# EAGLE design RS232 to TTL Converter (MAX3232IDR) (EAGLE 9.1.2)

## Sheet 1 of 2
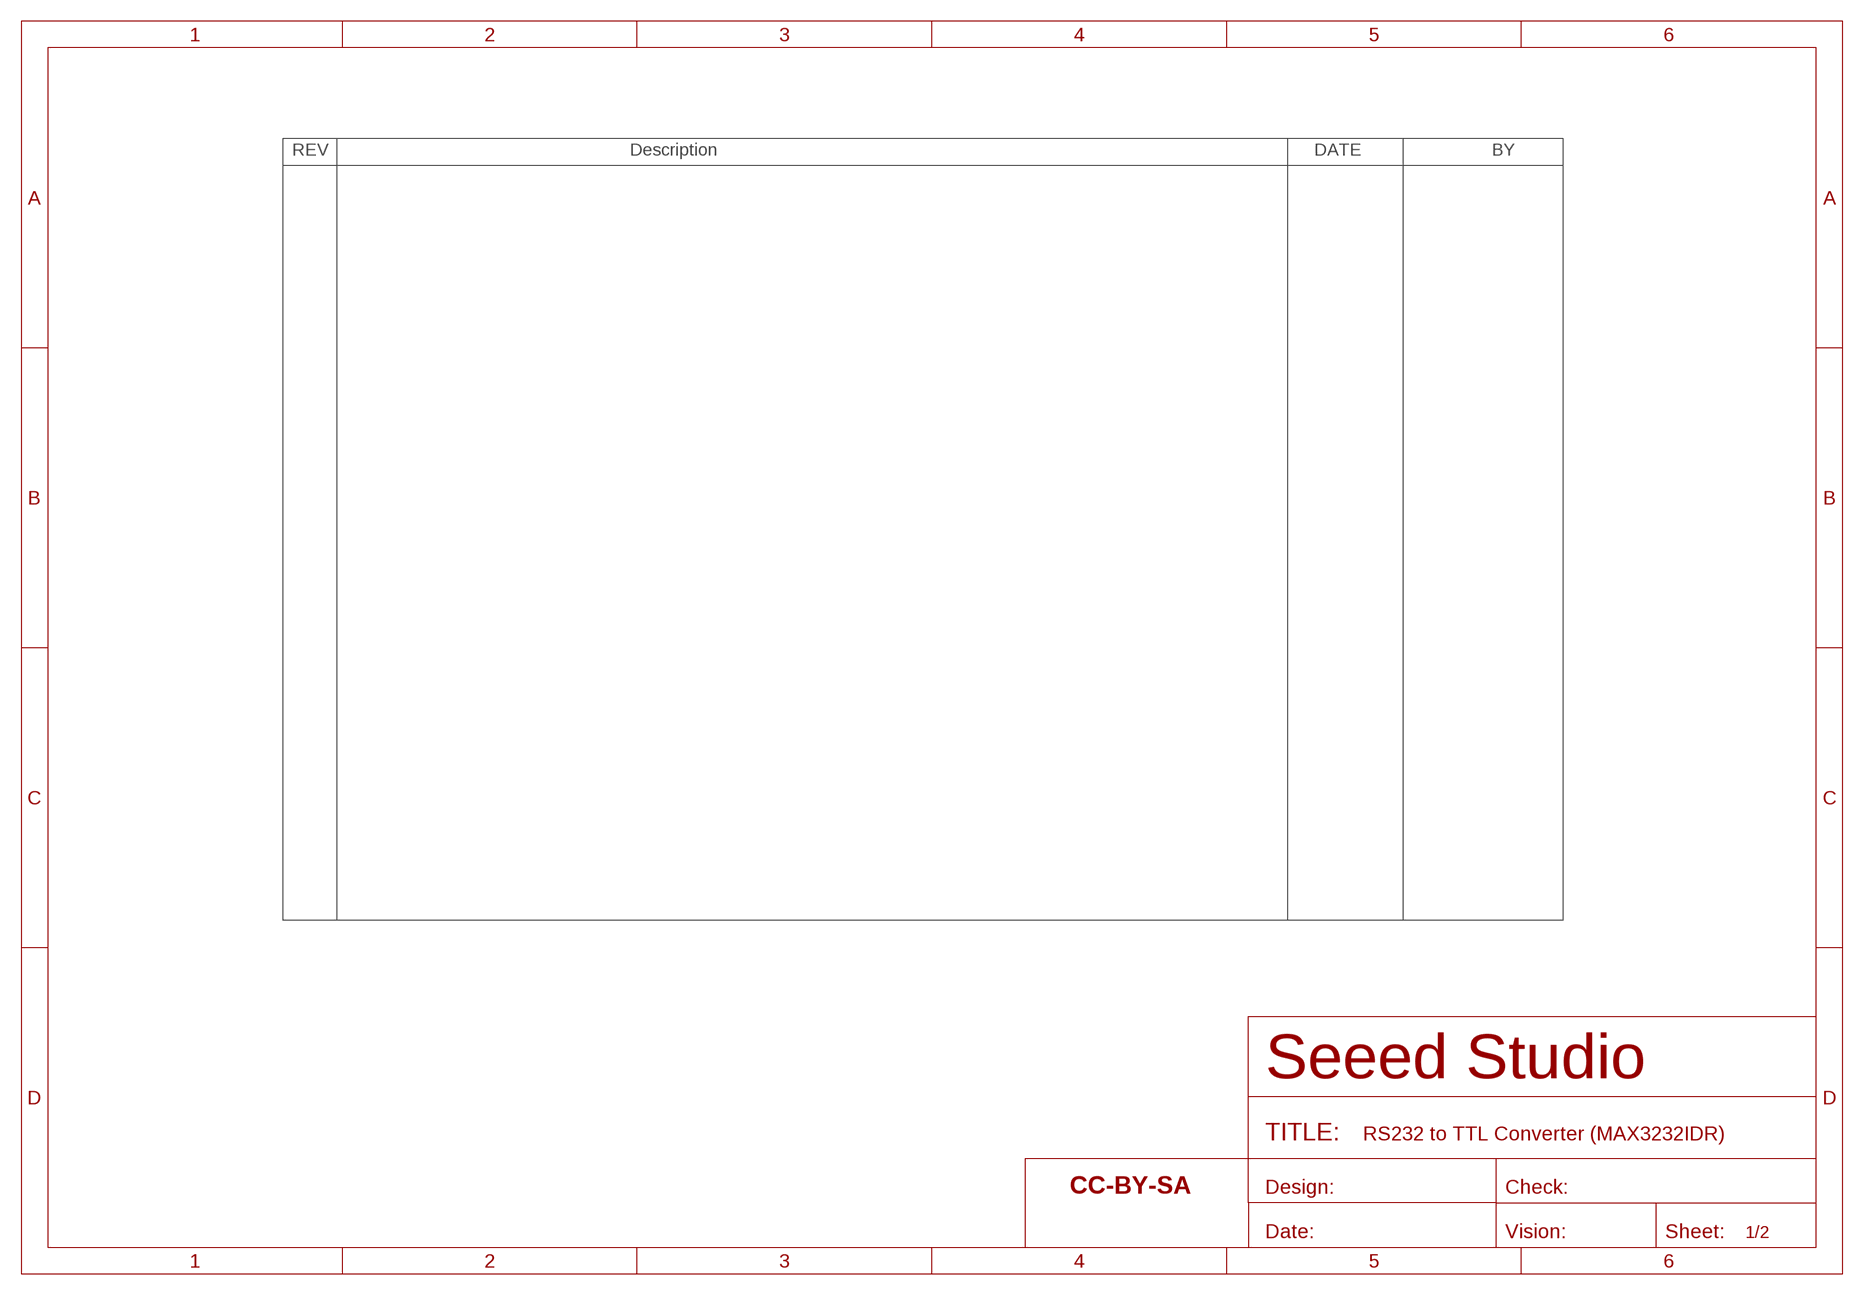
[diagram p0: schematic, sheet 1]

### Parts
FR1  SEEEDSTUDIO-OPEN-SCH-FRAME  [SEEEDSTUDIO-PCB-FRAME]

## Sheet 2 of 2
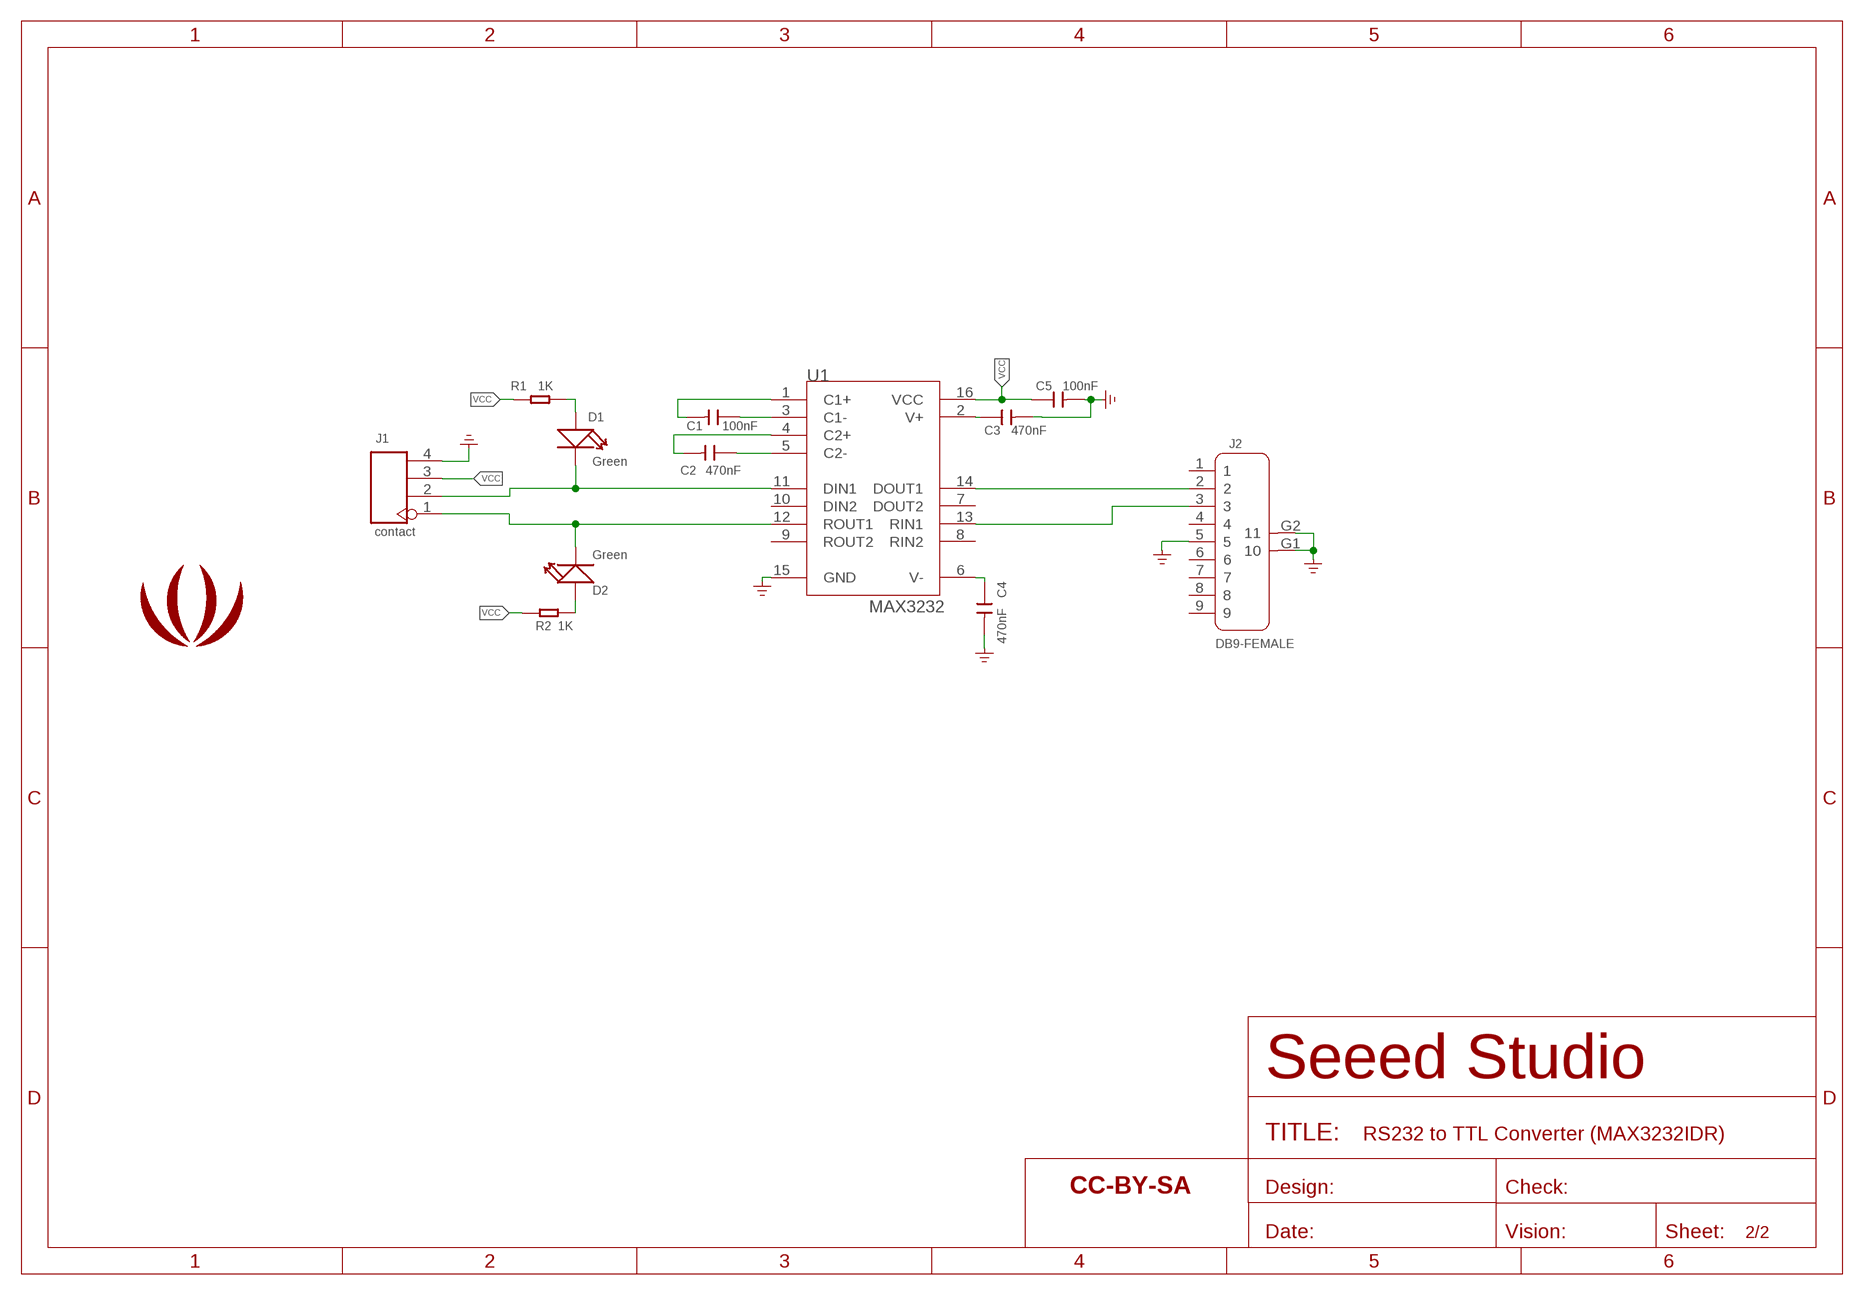
[diagram p1: schematic, sheet 2]

### Parts
C1  100nF  CAP-0603  [C0603]
C2  470nF  CAP-0603  [C0603]
C3  470nF  CAP-0603  [C0603]
C4  470nF  CAP-0603  [C0603]
C5  100nF  CAP-0603  [C0603]
D1  Green  LED'0603'  [LED-0603]
D2  Green  LED'0603'  [LED-0603]
FR2  SEEEDSTUDIO-OPEN-SCH-FRAME  [SEEEDSTUDIO-PCB-FRAME]
J1  contact  HEADER-4P-65/35MIL  [H4-2.54]
J2  DB9-FEMALE  DSUB-CONNECTOR-9'FEMAL'  [DSUB9+2P-2.77-90D-FEMALE]
R1  1K  RES-0603  [R0603]
R2  1K  RES-0603  [R0603]
U1  MAX3232  RF-MAX232D  [SOIC16-1.27-10X3.9MM]
U$2  LOGO-SEEED-BIG-SILK  [SEEED-SILK-280*268MIL]

### Nets
232-RXD: J2.3 U1.13(RIN1)
232-TXD: J2.2 U1.14(DOUT1)
GND: C3.2 C4.2 C5.2 J1.4 J2.5 J2.G1 J2.G2 U1.15(GND) ; supply symbol labelled GND_POWER
N$1: C1.2 U1.1(C1+)
N$2: C1.1 U1.3(C1-)
N$3: C2.2 U1.4(C2+)
N$4: C2.1 U1.5(C2-)
N$5: C3.1 U1.2(V+)
N$6: C4.1 U1.6(V-)
N$7: D1.+ R1.1
N$8: D2.+ R2.2
N$9: D1.- J1.2 U1.11(DIN1)
N$10: D2.- J1.1 U1.12(ROUT1)
VCC: C5.1 J1.3 R1.2 R2.1 U1.16(VCC)
Unconnected: J2.1 J2.4 J2.6 J2.7 J2.8 J2.9 U1.7(DOUT2) U1.8(RIN2) U1.9(ROUT2) U1.10(DIN2)

## Library data of the parts
C1-C5 = Discrete-new:CAP: Ceramic Capacitors
D1 D2 = Discrete-new:LED
FR1 FR2 = moudle-new:SEEEDSTUDIO-OPEN-SCH-FRAME
J1 = Connector-new:HEADER-4P
J2 = Connector-new:DSUB-CONNECTOR-9: 9+2P-2.77-FEMALE:320110019;9+2P-2.77-MALE:320110017
R1 R2 = Discrete-new:RES
U1 = IC-new:RF-MAX232D: 310060023
U$2 = logo:LOGO-SEEED; PARTNO: DNP

## Board
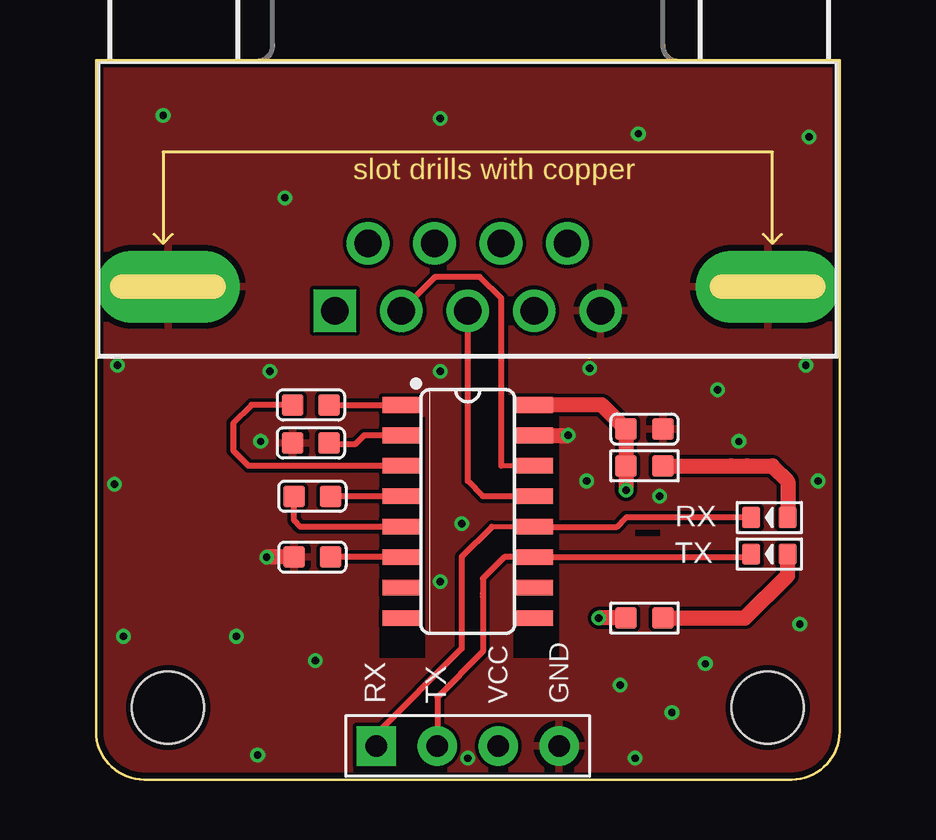
[diagram p2: board, top side]
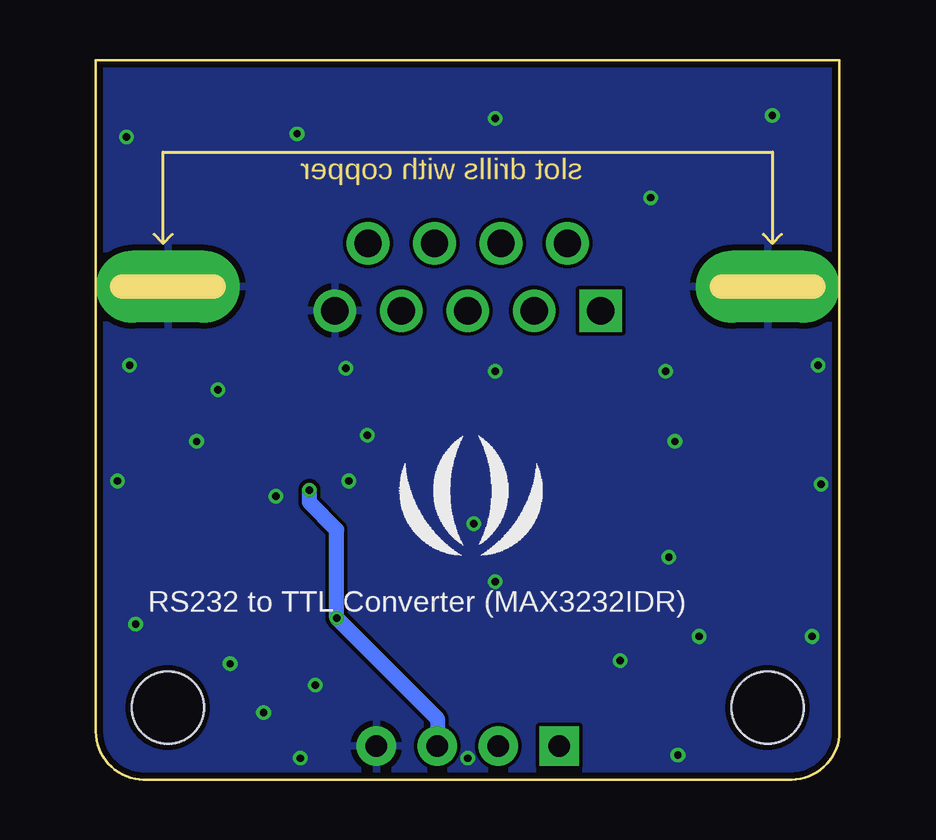
[diagram p3: board, bottom side, seen from below]

Size 31 x 30 mm. Coordinates in mm from the lower left corner, seen from the top.
Outline: 0,2 arc90 2,0 29,0 arc90 31,2 31,30 0,30 0,2
Copper layers (1*16): Top 0.035mm / dielectric 1.5mm / Bottom 0.035mm
Design rules "SeeedStudio_2layer_DRU_no_angle_20140221": minimum track width 1mil, minimum drill 10mil, track to track 6mil, track to pad 6mil, pad to pad 6mil, via to via 6mil, smd to smd 0mil, copper to edge 10mil, drill to drill 10mil, minimum pad ring 4mil, minimum via ring 4mil, stop-mask expansion 2mil, vias tented up to drill 25mil, thermal gap 10mil
Holes 3 mm at 28,3 3,3
tRestrict: area 22.5,10.2 to 23.5,10.4; area 11.8,5.1 to 13.7,15.1; area 17.4,5.1 to 19.3,15.1

### Footprints (pad centres in the part's own frame; a part is rotated, then mirrored left to right if it is on the bottom)
C0603 = smd 0.889 x 0.889: 1 0,0.762; 2 0,-0.762
LED-0603 = smd 0.762 x 0.889: + 0.762,0; - -0.762,0
H4-2.54 = drill 0.889 pad 1.651 square: 1 0,3.81 | drill 0.889 pad 1.651: 2 0,1.27; 3 0,-1.27; 4 0,-3.81
DSUB9+2P-2.77-90D-FEMALE = drill 1.143 pad 1.778 square: 1 5.54,0.9 | drill 1.143 pad 1.778: 2 2.77,0.9; 3 0,0.9; 4 -2.77,0.9; 5 -5.54,0.9; 6 4.155,-1.91; 7 1.385,-1.91; 8 -1.385,-1.91; 9 -4.155,-1.91 | drill 1 pad 3 long: G1 12.5,-0.1; G2 -12.5,-0.1
R0603 = smd 0.889 x 0.889: 1 0,0.762; 2 0,-0.762
SOIC16-1.27-10X3.9MM = smd 0.66 x 1.524: 1 -4.445,-2.794; 2 -3.175,-2.794; 3 -1.905,-2.794; 4 -0.635,-2.794; 5 0.635,-2.794; 6 1.905,-2.794; 7 3.175,-2.794; 8 4.445,-2.794; 9 4.445,2.794; 10 3.175,2.794; 11 1.905,2.794; 12 0.635,2.794; 13 -0.635,2.794; 14 -1.905,2.794; 15 -3.175,2.794; 16 -4.445,2.794

### Placement (x,y rotation side)
C1  8.95,15.62 90 top
C2  9.02,11.81 90 top
C3  8.95,14.03 270 top
C4  9.02,9.27 270 top
C5  22.86,14.61 90 top
D1  28.07,9.4 0 top
D2  28.07,10.92 0 top
FR1  -0.64,-16.51 0 top  (outside the outline)
FR2  -0.64,-8.89 0 top  (outside the outline)
J1  15.49,1.4 90 top
J2  15.49,20.45 180 top
R1  22.86,6.73 270 top
R2  22.86,13.08 90 top
U1  15.49,11.18 270 top
U$2  15.37,11.05 0 bottom

### Tracks (layer width: path | path; a pad name or v marks a point on that pad's centre or on a via)
232-RXD
  Top 0.254: J2.3 15.49,12.45 16.13,11.81 U1.13
232-TXD
  Top 0.203: U1.14 16.89,13.08
  Top 0.254: 16.89,13.08 16.89,20.07 16,20.95 14.13,20.95 J2.2
GND  (via drill 0.3 pad 0.61)
  Top 0.635: C4.2 v7.11,9.27 | U1.15 v19.68,14.35
  other vias: 6.86,14.1 9.14,4.95 6.73,1.02 1.14,5.97 0.76,12.32 0.89,17.27 7.24,17.02 14.35,17.02 20.57,17.14 29.59,17.27 30.1,12.45 29.34,6.48 21.84,3.94 26.8,14.1 20.45,12.45 15.24,10.67 14.35,8.26 2.79,27.69 14.35,27.56 22.61,26.92 29.72,26.8 7.87,24.26 24,2.79 23.5,11.81 15.49,0.89 22.48,0.89 25.91,16.26 25.4,4.83 5.84,5.97
  pour Top: -1.14,31.88 31.88,31.88 31.88,-1.27 -1.14,-1.27
  pour Bottom: 3.94,31.88 31.88,31.88 31.88,-1.27 -1.14,-1.27 -1.14,31.88
N$1
  Top 0.254: C1.2 U1.1
N$2
  Top 0.254: C1.1 6.48,15.62 5.71,14.86 5.71,13.72 6.35,13.08 U1.3
N$3
  Top 0.254: U1.4 C2.2
  Top 0.635: 12.83,11.81 U1.4
N$4
  Top 0.254: U1.5 8.51,10.54 8.26,10.79 C2.1
N$5
  Top 0.254: U1.2 11.18,14.35 10.79,13.97 9.78,13.97 C3.1
N$6
  Top 0.254: U1.6 C4.1
N$7
  Top 0.635: R1.1 27.05,6.73 28.83,8.51 D1.+
N$8
  Top 0.635: R2.2 26.46,13.08 26.48,13.07 27.12,13.07 27.13,13.08 28.19,13.08 28.83,12.45 D2.+
N$9
  Top 0.203: U1.11 17.91,9.27
  Top 0.254: 16.13,7.75 16.13,7.62 | 16.13,7.62 16.13,5.33 14.22,3.43 J1.2 | 16.13,7.62 16.13,8.38 17.02,9.27 U1.11 27.18,9.27 D1.-
N$10
  Top 0.203: U1.12 16.5,10.54
  Top 0.254: 16.5,10.54 15.24,9.28 15.24,5.46 11.68,1.91 J1.1 | D2.- 22.1,10.92 21.72,10.54 U1.12
VCC  (via drill 0.3 pad 0.61)
  Top 0.635: U1.16 21.08,15.62 C5.1 R2.1 v22.1,12.06 | R1.2 v20.95,6.73
  Bottom 0.635: 18.03,3.81 18.35,4.13 | 18.35,4.13 v20.95,6.73 20.95,10.41 22.1,11.56 v22.1,12.06 | 18.35,4.13 16.76,2.54 J1.3

### Text on the board
tNames: RX | TX | RX | TX | VCC | GND
bNames: RS232 to TTL Converter (MAX3232IDR)